# EAGLE design Adafruit MPU6050 (EAGLE 9.6.0)
COMPANY: ADAFRUIT INDUSTRIES; DRAWN: KTOWN; REV: A; YEAR: 2019
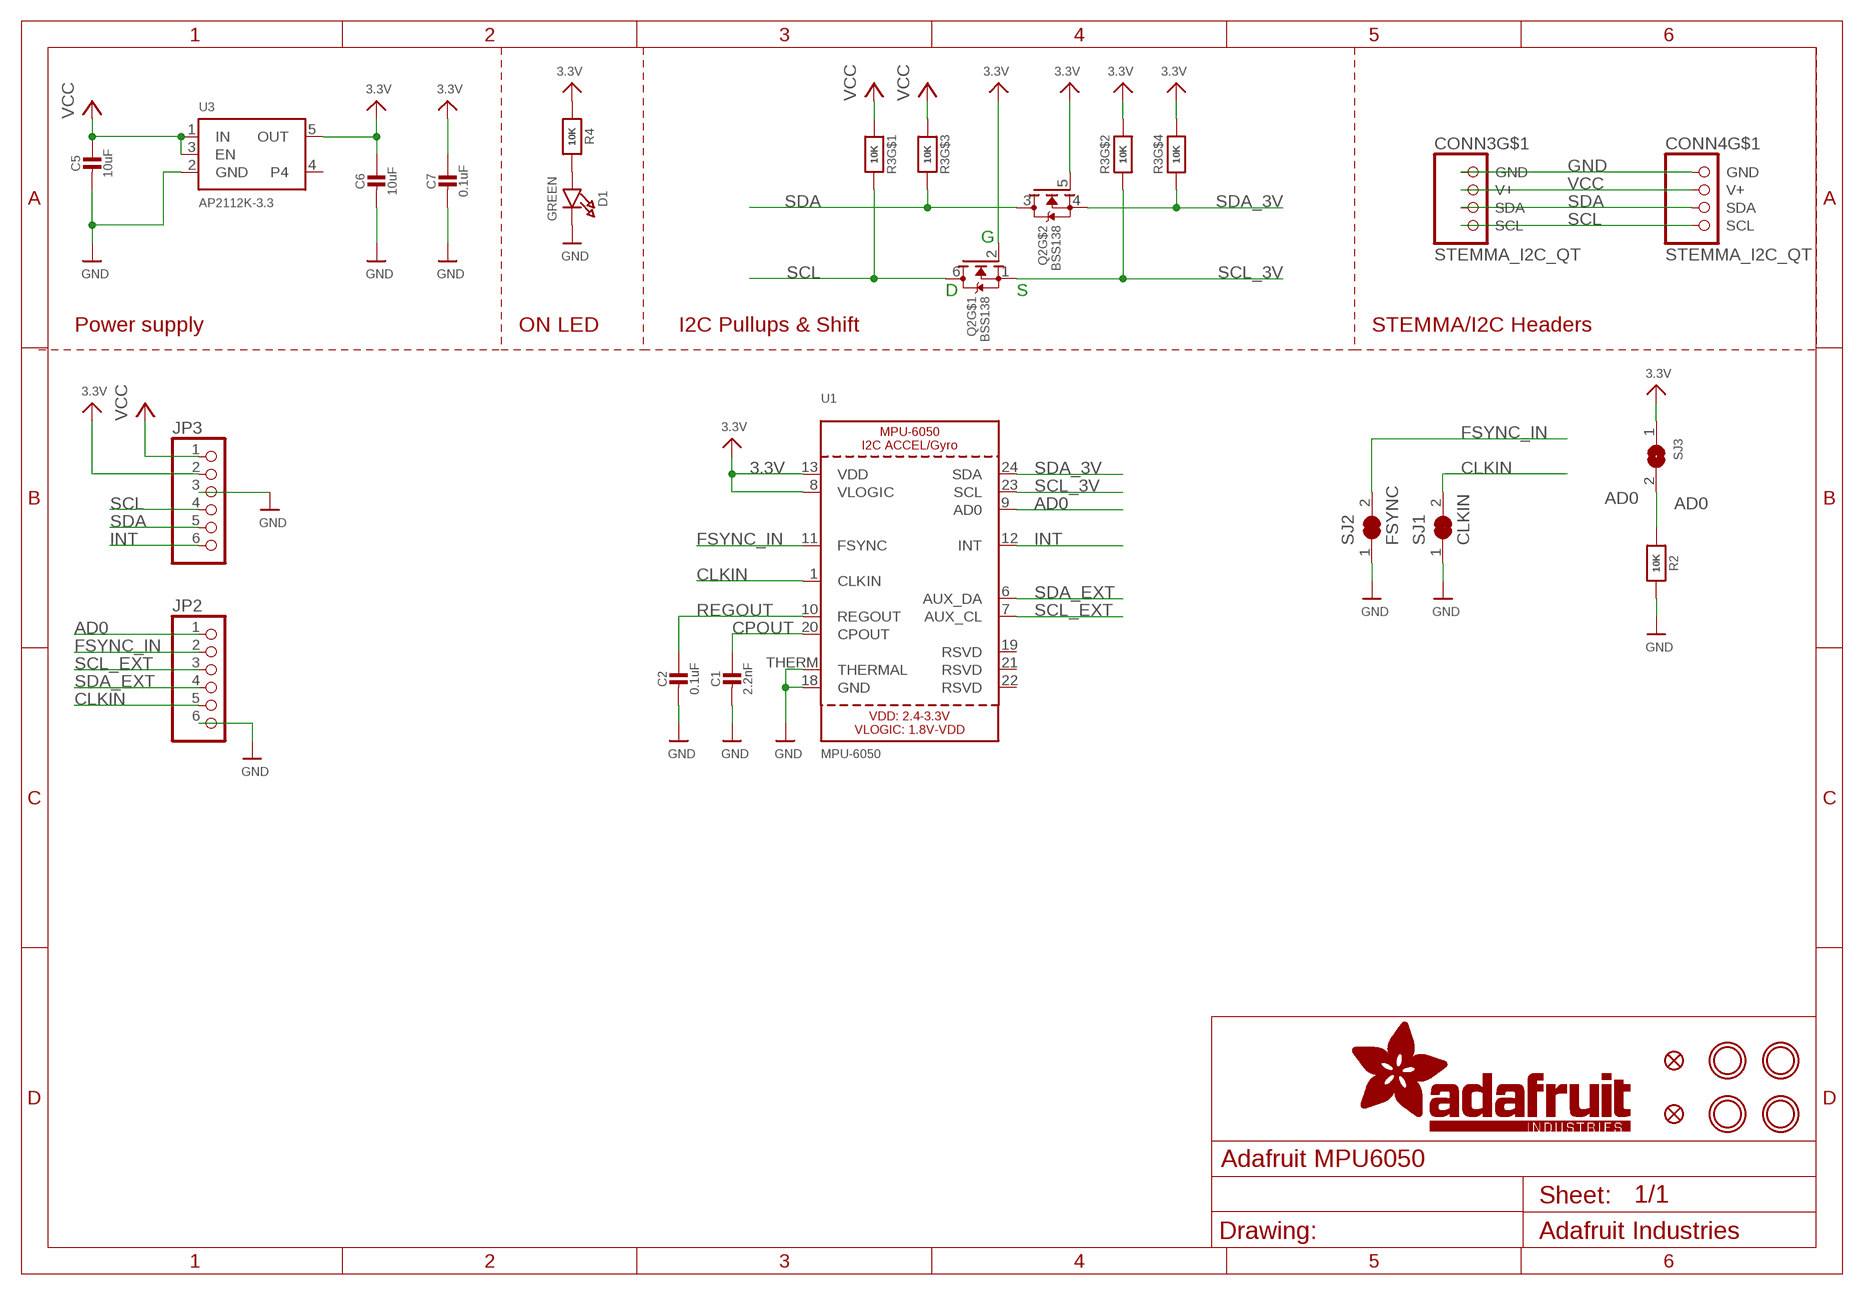
[diagram p0: schematic, sheet 1]

## Parts
C1  2.2nF  CAP_CERAMIC0603_NO  [0603-NO]
C2  0.1uF  CAP_CERAMIC0603_NO  [0603-NO]
C5  10uF  CAP_CERAMIC0805-NOOUTLINE  [0805-NO]
C6  10uF  CAP_CERAMIC0805-NOOUTLINE  [0805-NO]
C7  0.1uF  CAP_CERAMIC0603_NO  [0603-NO]
CONN3  STEMMA_I2C_QT  [JST_SH4]
CONN4  STEMMA_I2C_QT  [JST_SH4]
D1  GREEN  LED0603_NOOUTLINE  [CHIPLED_0603_NOOUTLINE]
FID3  FIDUCIAL_1MM  [FIDUCIAL_1MM]
FID4  FIDUCIAL_1MM  [FIDUCIAL_1MM]
JP2  HEADER-1X6ROUND  [1X06_ROUND]
JP3  HEADER-1X670MIL  [1X06_ROUND_70]
Q2  BSS138  MOSFET-N_DUAL  [SOT363]
R2  10K  RESISTOR_0603_NOOUT  [0603-NO]
R3  10K  RESISTOR_4PACK  [RESPACK_4X0603]
R4  10K  RESISTOR_0603_NOOUT  [0603-NO]
SJ1  CLKIN  SOLDERJUMPER_CLOSED  [SOLDERJUMPER_CLOSEDWIRE]
SJ2  FSYNC  SOLDERJUMPER_CLOSED  [SOLDERJUMPER_CLOSEDWIRE]
SJ3  SOLDERJUMPER  [SOLDERJUMPER_ARROW_NOPASTE]
U1  MPU-6050  [QFN24_4MM_SMSC]
U3  AP2112K-3.3  VREG_SOT23-5  [SOT23-5]
U$39  MOUNTINGHOLE2.5  [MOUNTINGHOLE_2.5_PLATED]
U$40  MOUNTINGHOLE2.5  [MOUNTINGHOLE_2.5_PLATED]
U$42  MOUNTINGHOLE2.5  [MOUNTINGHOLE_2.5_PLATED]
U$43  MOUNTINGHOLE2.5  [MOUNTINGHOLE_2.5_PLATED]

## Nets
3.3V: C6.1 C7.1 JP3.2 Q2.2(G) Q2.5(G) R3.2 R3.4 R4.1 SJ3.1 U1.8(VLOGIC) U1.13(VDD) U3.5(OUT)
AD0: JP2.1 R2.1 SJ3.2 U1.9(AD0)
CLKIN: JP2.5 SJ1.2 U1.1(CLKIN)
CPOUT: C1.1 U1.20(CPOUT)
FSYNC_IN: JP2.2 SJ2.2 U1.11(FSYNC)
GND: C1.2 C2.2 C5.2 C6.2 C7.2 CONN3.1(GND) CONN4.1(GND) D1.C JP2.6 JP3.3 R2.2 SJ1.1 SJ2.1 U1.18(GND) U1.THERM(THERMAL) U3.2(GND)
INT: JP3.6 U1.12(INT)
N$1: D1.A R4.2
REGOUT: C2.1 U1.10(REGOUT)
SCL: CONN3.4(SCL) CONN4.4(SCL) JP3.4 Q2.6(D) R3.8
SCL_3V: Q2.1(S) R3.7 U1.23(SCL)
SCL_EXT: JP2.3 U1.7(AUX_CL)
SDA: CONN3.3(SDA) CONN4.3(SDA) JP3.5 Q2.3(D) R3.6
SDA_3V: Q2.4(S) R3.5 U1.24(SDA)
SDA_EXT: JP2.4 U1.6(AUX_DA)
VCC [highpower]: C5.1 CONN3.2(V+) CONN4.2(V+) JP3.1 R3.1 R3.3 U3.1(IN) U3.3(EN)
Unconnected: CONN3.MT1(MT) CONN3.MT2(MT) CONN4.MT1(MT) CONN4.MT2(MT) U1.19(RSVD) U1.21(RSVD) U1.22(RSVD) U3.4

## Notes on the sheet
- G
- D | S
- Power supply | ON LED | I2C Pullups & Shift | STEMMA/I2C Headers

## Library data of the parts
C1 C2 C5-C7 = microbuilder:CAP_CERAMIC: Ceramic Capacitors For new designs, use the packages preceded by an '_' character since they are more reliable: The following footprints should be used on most boards: _0402 - Standard footprint for regular board layouts _0603 - Standard footprint for regular board layouts _0805 - Standard footprint for regular board layouts _1206 - Standard footprint for regular board layouts For extremely tight-pitch boards where space is at a premium, the following 'micro-pitch' footprints can be used (smaller pads, no silkscreen outline, etc.): _0402MP - Micro-pitch footprint for very dense/compact boards _0603MP - Micro-pitch footprint for very dense/compact boards _0805MP - Micro-pitch footprint for very dense/compact boards _1206MP - Micro-pitch footprint for very dense/compact boards
CONN3 CONN4 = microbuilder:STEMMA_I2C
D1 = microbuilder:LED: LED 0603 - 0603 Surface Mount Package 2mA: Green LED - Low Power (3.9mcd, 2ma, 1.7Vf) - Digikey: 475-2709-2-ND Orange LED - Low Power (9.8mcd, 2ma, 1.8Vf) - Digikey: 475-1194-2-ND Red LED - Low Power (5mcd, 2ma, 1.8Vf) - Digikey: 475-1195-2-ND Yellow LED - Low Power (7mcd, 2ma, 1.8Vf) - Digikey: 475-1196-2-ND 5mA: Blue LED - Low Power (17mcd, 5ma, 2.9Vf) - Digikey: LNJ937W8CRACT-ND 0805 - 0805 Surface Mount Package 2mA: Red LED (8.8mcd, 2mA, 1.8Vf, Clear) - Low Power [Digikey: 475-2510-1-ND] Green LED (5mcd, 2mA, 1.8Vf, Clear) - Low Power [Digikey: 475-2730-1-ND] Yellow LED (11.3mcd, 2mA, 1.8Vf, Clear) - Low Power [Digikey: 475-2555-1-ND] 20mA: Red LED (104mcd, 20mA, Diffused) - LS R976 [Digikey: 475-1278-6-ND] Red LED (12mcd, 20mA, 2.0Vf, Clear) - APT2012EC [Digikey: 754-1128-1-ND] Green LED (15mcd, 20mA, 2.2Vf, Clear) - APT2012GC [Digikey: 754-1131-1-ND] Orange LED (160mcd, 20mA, 2.1Vf, Clear) - APT2012SECK [Digikey: 754-1130-1-ND] 1206 - 1206 Surface Mount Package Green LED (26mcd, 20mA, Diffused) - LG N971 [Digikey: 475-1407-6-ND] Red LED (15mcd, 20mA, Diffused) - LH N974 [Digikey: 475-1416-6-ND] Cree - Cree High-Power Surface Mount LEDs XPEBWT-L1-0000-00D50 - White 111lm 350mA 2.9Vf 6200K 110° XTEAWT-00-0000-00000LEE3 - White 114lm 350mA 2.85Vf 5000K 115° Everlight - Everlight 45-21 Series Surface Mount LEDs 45-21/QK2C-B2832AC2CB2/2T - Warm White 2000mcd 20mA 3.25Vf 3050K 120° 45-21/LK2C-B38452C4CB2/2T - Nuetral White 2000mcd 20mA 3.25Vf 4150K 120° 45-21/LK2C-B50634C6CB2/2T - Cold White 2200mcd 20mA 3.25Vf 5650K 120° PLCC2 Reverse Mount LS T77K-J1L2-1-0-2-R18-Z - Red 11.25mcd 2mA 1.8Vf 630nm 120° LO T77K-L1M2-24-Z - Orange 19.6mcd 2mA 1.8Vf 606nm 120° LY T77K-K2M1-26-Z - Yellow 15.7mcd 2mA 1.8Vf 587nm 120°
FID3 FID4 = microbuilder:FIDUCIAL: Fiducial Alignment Points Various fiducial points for machine vision alignment.; BOM: EXCLUDE
JP2 JP3 = microbuilder:HEADER-1X6: PIN HEADER
Q2 = microbuilder:MOSFET-N_DUAL: Dual N-Channel MOSFET SOT363 (2.0x1.25mm) 2N7002PS - 60V, 320mA [Digikey: 568-5984-1-ND]
R2 R4 = microbuilder:RESISTOR: Resistors For new designs, use the packages preceded by an '_' character since they are more reliable: The following footprints should be used on most boards: _0402 - Standard footprint for regular board layouts _0603 - Standard footprint for regular board layouts _0805 - Standard footprint for regular board layouts _1206 - Standard footprint for regular board layouts For extremely tight-pitch boards where space is at a premium, the following 'micro-pitch' footprints can be used (smaller pads, no silkscreen outline, etc.): _0402MP - Micro-pitch footprint for very dense/compact boards _0603MP - Micro-pitch footprint for very dense/compact boards _0805MP - Micro-pitch footprint for very dense/compact boards _1206MP - Micro-pitch footprint for very dense/compact boards
R3 = microbuilder:RESISTOR_4PACK: Resistor Packs (4 resistors) 4 x 0603 10K 1/16W - Digikey: YC164J-10KCT-ND
SJ1 SJ2 = microbuilder:SOLDERJUMPER_CLOSED: Solder Jumper - Closed These solder jumpers are closed by default CLOSEDWIRE - 10 mil trace between pads that can be cut and resoldered later CLOSEDPERM - 63 mil trace between pads for a permanent connection (used to 'bridge' two signals, a shameless hack for Eagle). Can double as a test point as well (no cream layer)
SJ3 = microbuilder:SOLDERJUMPER: SMD Solder JUMPER Solder the two pads together to create a connection, or remove the solder to break it. REFLOW - Use this footprint for solder paste and reflow ovens. WAVE - Use this footprint for hand-soldering (larger pads). CLOSED - Has a trace between the two pads to ensure it is closed by default. The trace needs to be cut to disable the jumper, and can be closed again by creating a solder bridge between the two pads.; BOM: EXCLUDE
U1 = microbuilder:MPU-6050: MPU-6050 3-Axis Accelerometer/Gyroscope
U3 = microbuilder:VREG_SOT23-5: SOT23-5 Fixed Voltage Regulators Part Current Out V Out V In V Dropout θJA (°C/W) TJ (°C) Digikey Part No. ADP121 150mA 3.3V 3.4-5.5V 0.09V @ 150mA -- -- ADP121-AUJZ33R7CT-ND ADP121 150mA 3.0V 3.1-5.5V 0.09V @ 150mA -- -- ADP121-AUJZ30R7CT-ND ADP122 300mA 3.3V 3.4-5.5V 0.085V @ 300mA -- -- ADP122AUJZ-3.3-R7CT-ND ADP1712 300mA 3.3V 3.5-5.5V 0.17V @ 300mA -- -- ADP1712AUJZ-3.3-R7TR-ND AP7311 (Low Cost) 150mA 3.3V 3.5-6V 0.15V @ 150mA -- -- AP7311-33WG-7DICT-ND LD39015M18R 150mA 1.8V 1.9V-5.5V 0.08V @ 100mA -- -- 497-6977-1-ND LP2985A-33DBVR 150mA 3.3V 3.3-16V 0.28V @ 150mA 206 150 296-18479-1-ND MCP1824T-3302E/OT 300mA 3.3V 3.5V-6V 0.2V @ 300mA -- -- MCP1824T-3302E/OTCT-ND MIC5205-2.5YM5 TR 150mA 2.5V 2.7-16V 0.165V @ 150mA -- -- 576-1257-2-ND MIC5205-3.0YM5 TR 150mA 3.0V 3.2V-16V 0.165V @ 150mA -- -- 576-1258-2-ND MIC5205-3.3YM5 TR 150mA 3.3V 3.5V-16V 0.165V @ 150mA -- -- 576-1259-2-ND TPS780330220 150mA 3.3V+2.2V 3.6-5.5V 250mV Max -- -- 296-23332-1-ND TDA3663/N1,135 100mA 3.3V 3.5-45V 0.18V @ 50mA -- -- 568-5343-1-ND Max operating temp can be calculated using θJA, TJ (max junction temperature), and power in watts. Set the "Maximum Ambient Temperature" until it reaches TJ ("Max Junction Temperature"), which is the absolute limit for safe use of the regulator: Heat Sink Temperature Calculator <http://www.daycounter.com/Calculators/Heat-Sink-Temperature-Calculator.phtml> For example, With 12V source into a 3.3V LP2985 and a 30mA load, we are dissipating (12V-3.3V) * 0.03A = 0.261W. With a θJA of 206 °C/W, a TJ of 150°C, and 261mW we can safely use the chip without a heat sink up to 75°C (=147.1°C Junction Temperature).
U$39 U$40 U$42 U$43 = microbuilder:MOUNTINGHOLE: Mounting Hole For #2 screws (0.086"/2.18mm width, 0.094"/2.4mm hole) use 2.5mm; BOM: EXCLUDE

## Net classes
1 highpower: width 0.406 mm, drill 0.483 mm
2 lowpower: width 0.305 mm, drill 0.483 mm

## Board
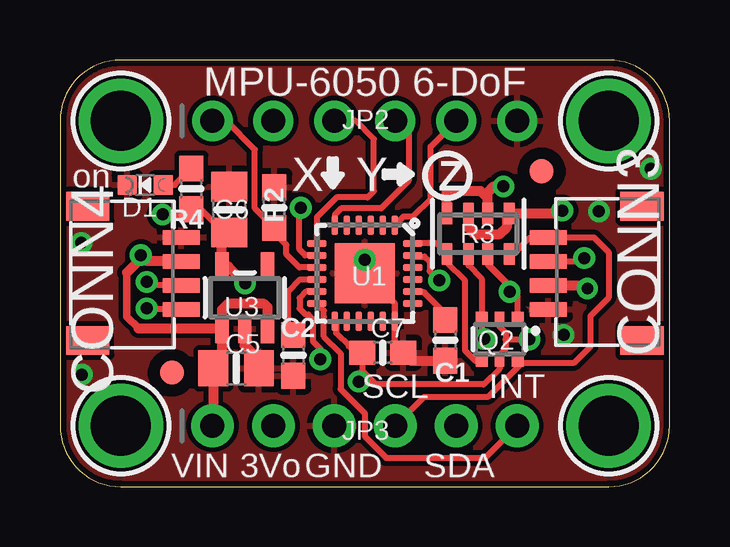
[diagram p1: board, top side]
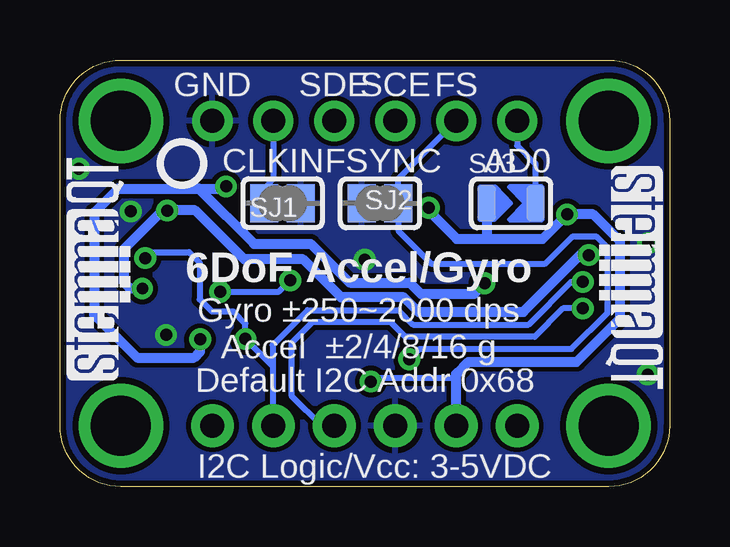
[diagram p2: board, bottom side, seen from below]

Size 25.4 x 17.78 mm. Coordinates in mm from the lower left corner, seen from the top.
Outline: 0,15.24 0,2.54 arc90 2.54,0 22.86,0 arc90 25.4,2.54 25.4,15.24 arc90 22.86,17.78 2.54,17.78 arc90 0,15.24
Copper layers (1*16): Top 0.035mm / dielectric 1.5mm / Bottom 0.035mm
Design rules "adafruit 7-7": minimum track width 6mil, minimum drill 15.5mil, track to track 8mil, track to pad 7mil, pad to pad 7mil, via to via 7mil, smd to smd 7mil, copper to edge 10mil, drill to drill 8mil, minimum pad ring 10mil, minimum via ring 8mil, stop-mask expansion 2mil, vias tented up to drill 20mil, thermal gap 10mil

### Footprints (pad centres in the part's own frame; a part is rotated, then mirrored left to right if it is on the bottom)
0603-NO = smd 1.075 x 1: 1 -0.85,0; 2 0.85,0
0805-NO = smd 1.24 x 1.5: 1 -0.95,0; 2 0.95,0
JST_SH4 = smd 0.6 x 1.55: 1 -1.5,2.514; 2 -0.5,2.514; 3 0.5,2.514; 4 1.5,2.514 | smd 1.2 x 1.8: MT1 -2.8,-1.386; MT2 2.8,-1.386
CHIPLED_0603_NOOUTLINE = smd 0.8 x 0.8: A 0,-0.75; C 0,0.75
FIDUCIAL_1MM = smd 1 x 1: 1 0,0
1X06_ROUND = drill 1 pad 1.676: 1 -6.35,0; 2 -3.81,0; 3 -1.27,0; 4 1.27,0; 5 3.81,0; 6 6.35,0
1X06_ROUND_70 = drill 1 pad 1.778: 1 -6.35,0; 2 -3.81,0; 3 -1.27,0; 4 1.27,0; 5 3.81,0; 6 6.35,0
SOT363 = smd 0.5 x 0.5: 1 -0.75,-0.9; 3 0.75,-0.9; 4 0.75,0.9; 6 -0.75,0.9 | smd 0.4 x 0.5: 2 0,-0.9; 5 0,0.9
RESPACK_4X0603 = smd 0.45 x 0.9: 1 -1.3,-0.85; 2 -0.4,-0.85; 3 0.4,-0.85; 4 1.3,-0.85; 5 1.3,0.85; 6 0.4,0.85; 7 -0.4,0.85; 8 -1.3,0.85
SOLDERJUMPER_CLOSEDWIRE = smd 1.168 x 1.6: 1 -0.762,0; 2 0.762,0 | smd 0.635 x 0.203: WIRE 0,0
SOLDERJUMPER_ARROW_NOPASTE = smd 0.762 x 1.524: 1 -1.016,0; 2 1.016,0
QFN24_4MM_SMSC = smd 0.8 x 0.28: 1 -2,1.25; 2 -2,0.75; 3 -2,0.25; 4 -2,-0.25; 5 -2,-0.75; 6 -2,-1.25; 13 2,-1.25; 14 2,-0.75; 15 2,-0.25; 16 2,0.25; 17 2,0.75; 18 2,1.25 | smd 0.28 x 0.8: 7 -1.25,-2; 8 -0.75,-2; 9 -0.25,-2; 10 0.25,-2; 11 0.75,-2; 12 1.25,-2; 19 1.25,2; 20 0.75,2; 21 0.25,2; 22 -0.25,2; 23 -0.75,2; 24 -1.25,2 | smd 2.5 x 2.5: THERM 0,0
SOT23-5 = smd 0.55 x 1.2: 1 -0.95,-1.3; 2 0,-1.3; 3 0.95,-1.3; 4 0.95,1.3; 5 -0.95,1.3
MOUNTINGHOLE_2.5_PLATED = drill 2.5 pad 3.2: P$1 0,0

### Placement (x,y rotation side)
C1  16.05,6.1 270 top
C2  9.73,5.47 270 top
C5  7.34,4.93 0 top
C6  7.05,11.54 90 top
C7  13.45,5.59 0 top
CONN3  22.86,8.89 90 top
CONN4  2.54,8.89 270 top
D1  3.56,12.57 90 top
FID3  20.07,13.14 0 top
FID4  4.66,4.75 0 top
JP2  12.7,15.24 0 top
JP3  12.7,2.54 0 top
Q2  18.31,6.15 180 top
R2  8.93,11.63 90 top
R3  17.42,10.54 180 top
R4  5.47,12.41 90 top
SJ1  16.13,11.81 180 bottom
SJ2  12.06,11.81 0 bottom
SJ3  6.6,11.81 0 bottom
U1  12.7,8.89 270 top
U3  7.7,7.87 0 top
U$39  2.54,15.24 0 top
U$40  22.86,15.24 0 top
U$42  2.54,2.54 0 top
U$43  22.86,2.54 0 top
U$46  [PCBFEAT-REV-040]  20.32,13.46 0 bottom
U$47  [STEMMAQT]  22.48,4.45 90 bottom
U$48  [STEMMAQT]  2.92,13.34 270 bottom

### Tracks (layer width: path | path; a pad name or v marks a point on that pad's centre or on a via)
3.3V  (via drill 0.5)
  Top 0.254: U1.8 10.22,9.64 9.97,9.89 9.97,11.56 v10.03,11.62 | 12.6,4.83 13.16,4.26 17.65,4.26 18.31,4.92 Q2.5 18.31,5.5 18.57,5.75 18.57,6.14 | 12.6,4.83 C7.1 12.31,5.59 12.03,5.87 12.04,5.87 11.51,6.41 11.51,6.83 U1.13 | 18.57,6.14 18.57,6.41 18.31,6.67 Q2.2 | C6.1 6.97,10.62 6.72,10.7 5.86,11.56 R4.1 | 12.6,4.83 12.45,4.68 v12.45,4.38 | 18.57,6.14 v19.56,6.14
  Top 0.406: v7.71,8.47 7.01,9.17 U3.5 6.75,10.4 6.97,10.62 | v4.27,11.35 5.26,11.35 R4.1 | R3.4 16.12,12.32 17.53,12.32 17.7,12.15 17.82,12.28 | R3.2 17.82,12.28 | 17.82,12.28 18.06,12.51 v18.48,12.51
  Bottom 0.254: v12.45,4.38 12.28,4.55 9.04,4.55 8.86,4.73
  Bottom 0.406: v19.56,6.14 19.56,5.64 19.81,5.38 22.18,5.38 23.97,7.17 23.97,11.42 22.98,12.42 19.61,12.42 | v7.71,8.47 8.15,8.04 10.36,8.04 10.82,8.5 13.33,8.5 14.95,10.12 17.32,10.12 19.61,12.42 | JP3.2 8.89,4.7 8.86,4.73 8.38,5.21 3.87,5.21 2.06,7.01 2.06,10.23 3.18,11.35 v4.27,11.35 5.29,10.33 7.75,10.33 | 19.61,12.42 18.57,12.42 v18.48,12.51 | v10.03,11.62 10.03,11.49 8.87,10.33 7.75,10.33 | SJ3.1 7.62,10.46 7.75,10.33
AD0
  Top 0.254: U1.9 9.97,9.14 9.44,9.68 9.44,10.07 8.93,10.58 R2.1 8.12,11.6 8.12,14.04 6.92,15.24 JP2.1
  Bottom 0.254: JP2.1 6.35,14.22 5.59,13.46 SJ3.2
CLKIN
  Top 0.254: U1.1 14.32,11.26 14.72,11.26 15.44,11.98 15.44,14.17 JP2.5
  Bottom 0.254: JP2.5 16.51,12.83 16.89,12.45 SJ1.2
CPOUT
  Top 0.254: U1.20 15.08,8.14 15.14,8.09 15.19,8.09 16.05,7.22 C1.1
FSYNC_IN  (via drill 0.5)
  Top 0.254: U1.11 10.27,8.14 9.99,7.86 9.99,7.42 10.24,7.17 10.35,7.17 10.53,6.99 10.53,6.05 10.85,5.74 v10.85,5.31
  Bottom 0.254: v10.85,5.31 10.41,5.74 4.09,5.74 2.6,7.24 2.6,9.98 3.03,10.41 4.06,10.41 5.21,9.27 9.91,9.27 11.3,10.67 SJ2.2 11.3,12.83 JP2.2
GND  (via drill 0.5)
  Top 0.254: v12.7,9.46 U1.THERM 13.95,7.64 U1.18 13.95,5.94 C7.2
  Top 0.406: U3.2 7.7,5.89 8.29,5.3 C5.2 | C7.2 14.64,5.25 C1.2
  other vias: 0.91,4.67 22.45,11.47 20.98,6.32 0.89,10.16 24.61,13.25
  pour Top: 0,17.78 25.4,17.78 25.4,0 0,0
  pour Bottom: 0,17.78 25.4,17.78 25.4,0 0,0
INT
  Top 0.254: U1.12 11,7.34 11,7.08 10.99,7.08 10.99,6.26 11.69,5.55 11.69,4.07 12.7,3.06 12.7,2.1 13.59,1.21 17.72,1.21 JP3.6
N$1
  Top 0.254: D1.A 4.79,12.57 R4.2
REGOUT
  Top 0.254: C2.1 9.51,6.55 9.51,8.15 9.99,8.64 U1.10
SCL  (via drill 0.5)
  Top 0.254: R3.8 18.9,9.69 19.6,10.39 CONN3.4 22.25,10.39 22.86,9.78 22.86,7.87 22.1,7.11 22.1,5.84 21.4,5.14 19.17,5.14 Q2.6 19.09,5.28 19.11,5.28 19.23,5.15 17.82,3.73 15.16,3.73 JP3.4 | CONN4.4 3.66,7.39 v3.62,7.43
  Bottom 0.254: v3.62,7.43 4.45,7.43 5.63,6.25 11.01,6.25 11.61,6.85 14.88,6.85 15.76,5.97 15.76,3.8 14.5,2.54 JP3.4
SCL_3V  (via drill 0.5)
  Top 0.254: v18.73,8.13 18.73,8.38 17.82,9.29 R3.7 17.82,9.24 19.06,8 Q2.1 | U1.23 14.76,9.59 15.19,9.59 15.4,9.37 15.4,8.98 15.79,8.6 v15.81,8.6
  Bottom 0.254: v18.73,8.13 16.28,8.13 v15.81,8.6
SCL_EXT
  Top 0.254: U1.7 10.7,11.23 11.53,12.06 12.82,12.06 13.08,12.32 13.08,14.48 12.32,15.24 JP2.3
SDA  (via drill 0.5)
  Top 0.254: R3.6 17.02,9.22 17.57,8.68 17.57,6.16 v17.67,6.16 17.57,6.22 Q2.3 | CONN4.3 3.72,8.39 v3.62,8.53 | CONN3.3 21.71,9.39 v21.84,9.53
  Bottom 0.254: v21.84,9.53 21.59,9.78 20.02,9.78 19.58,9.34 19.58,7.81 19.07,7.3 18.18,7.3 17.67,6.79 v17.67,6.16 16.54,5.03 | 16.54,5.03 16.54,5.9 15.08,7.36 11.29,7.36 10.69,6.76 5.88,6.76 4.1,8.53 v3.62,8.53 | 16.54,5.03 16.54,2.57 JP3.5
SDA_3V
  Top 0.254: U1.24 15.68,10.14 R3.5 16.12,9.36 16.88,8.6 16.88,5.67 17.31,5.25 Q2.4
SDA_EXT
  Top 0.254: U1.6 11.45,11.34 11.72,11.6 13.38,11.6 14.53,12.75 14.53,14.68 JP2.4
VCC  (via drill 0.48, 0.5)
  Top 0.305: 3.27,6.59 2.79,7.08 2.79,8.92
  Top 0.406: CONN4.2 4.99,9.45 4.5,9.45 4.45,9.4 3.62,9.4 v3.37,9.65 3.37,9.5 2.79,8.92 | U3.3 8.65,7.48 8.51,7.62 6.99,7.62 6.75,7.38 U3.1 | U3.1 6.75,4.78 C5.1 6.39,2.91 6.18,2.88 6.35,2.71 JP3.1 | R3.3 17.02,10.79 17.29,10.52 18.33,10.52 18.61,10.79 18.61,11.27 R3.1 20.82,11.39 v20.93,11.51 | CONN3.2 21.84,8.39 v21.97,8.26 | 3.27,6.59 6.72,6.59 U3.1
  Bottom 0.406: v3.37,9.65 3.73,9.65 6.1,7.29 10.47,7.29 11.07,7.89 13.69,7.89 15.27,9.47 17.72,9.47 19.77,11.52 20.92,11.52 v20.93,11.51 21.13,11.51 22.73,9.91 22.73,8.51 22.48,8.26 v21.97,8.26

### Text on the board
tPlace: MPU-6050 6-DoF | on | X | Y | Z | SCL | INT | VIN | 3Vo | GND | SDA
bPlace: FS | SCE | SDE | GND | AD0 | FSYNC | CLKIN | 6DoF Accel/Gyro | Gyro ±250~2000 dps | Accel ±2/4/8/16 g | Default I2C Addr 0x68 | I2C Logic/Vcc: 3-5VDC